# Altium schematic sheet OVERVIEW.SchDoc
size 558 x 431 mm; SheetNumber: 3; SheetTotal: 25; Sheet_Name: OVERVIEW; Size: 11x17
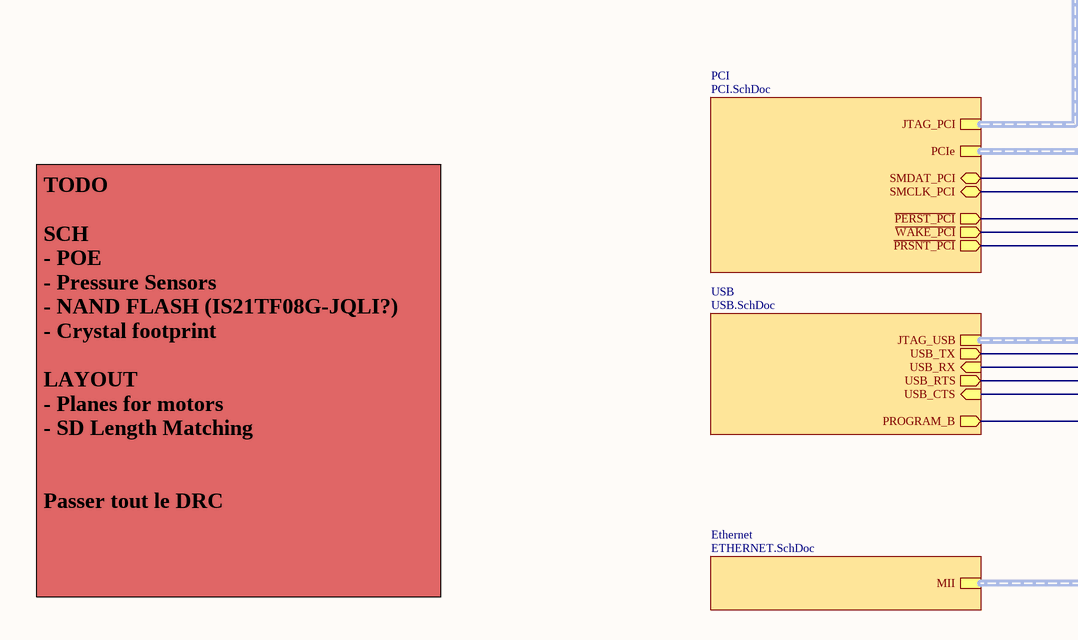
[diagram p0: OVERVIEW.SchDoc, top left]
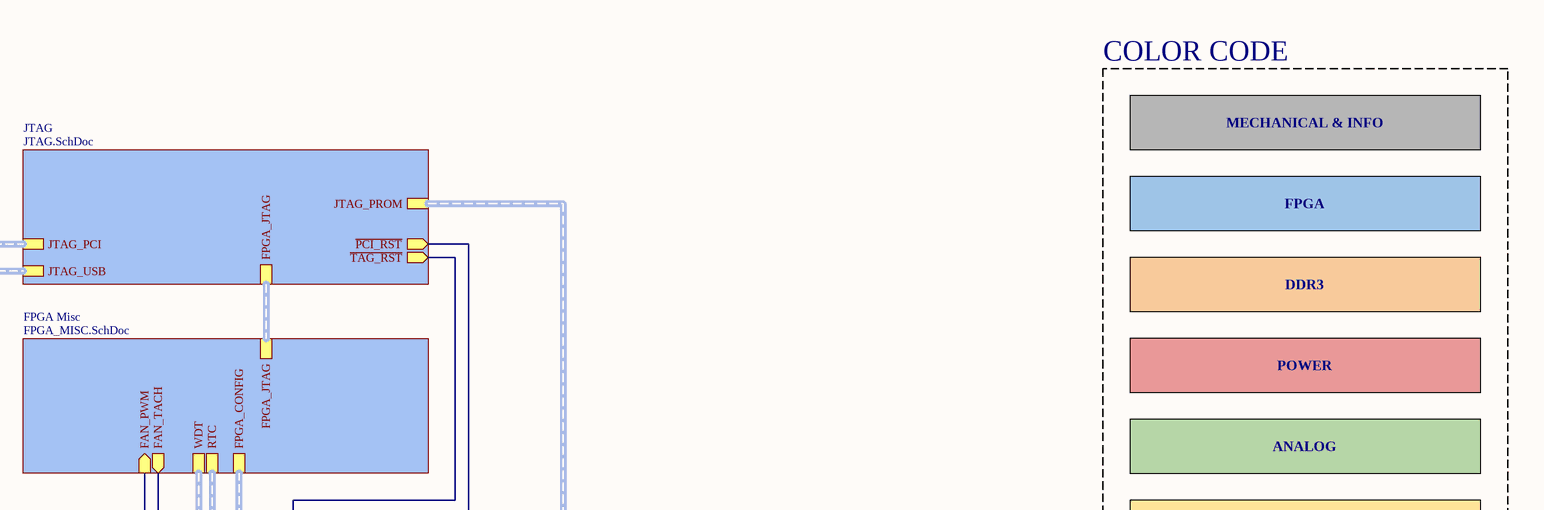
[diagram p1: OVERVIEW.SchDoc, top right]
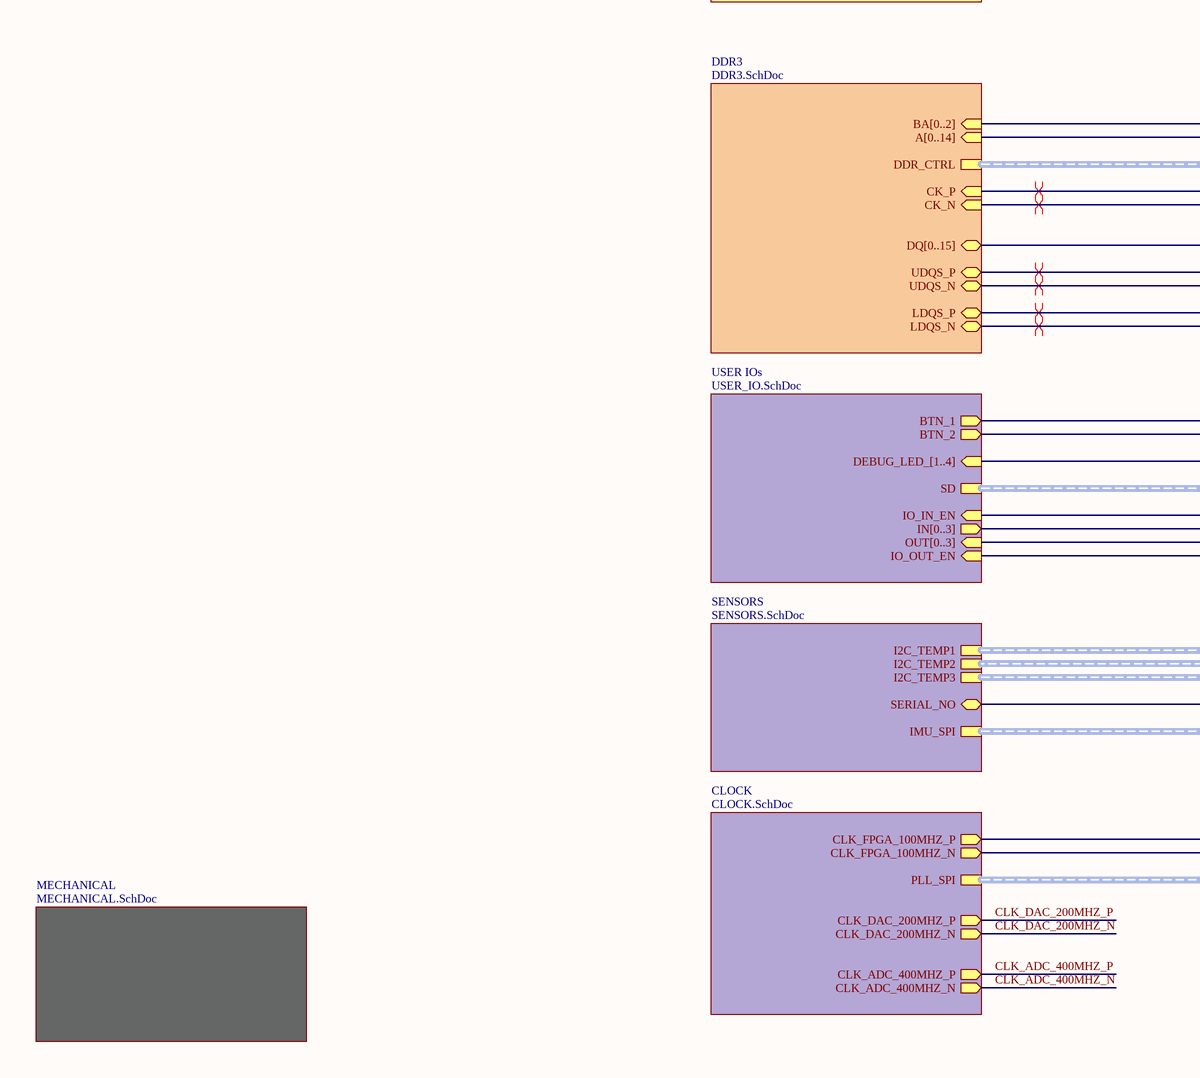
[diagram p2: OVERVIEW.SchDoc, bottom left]
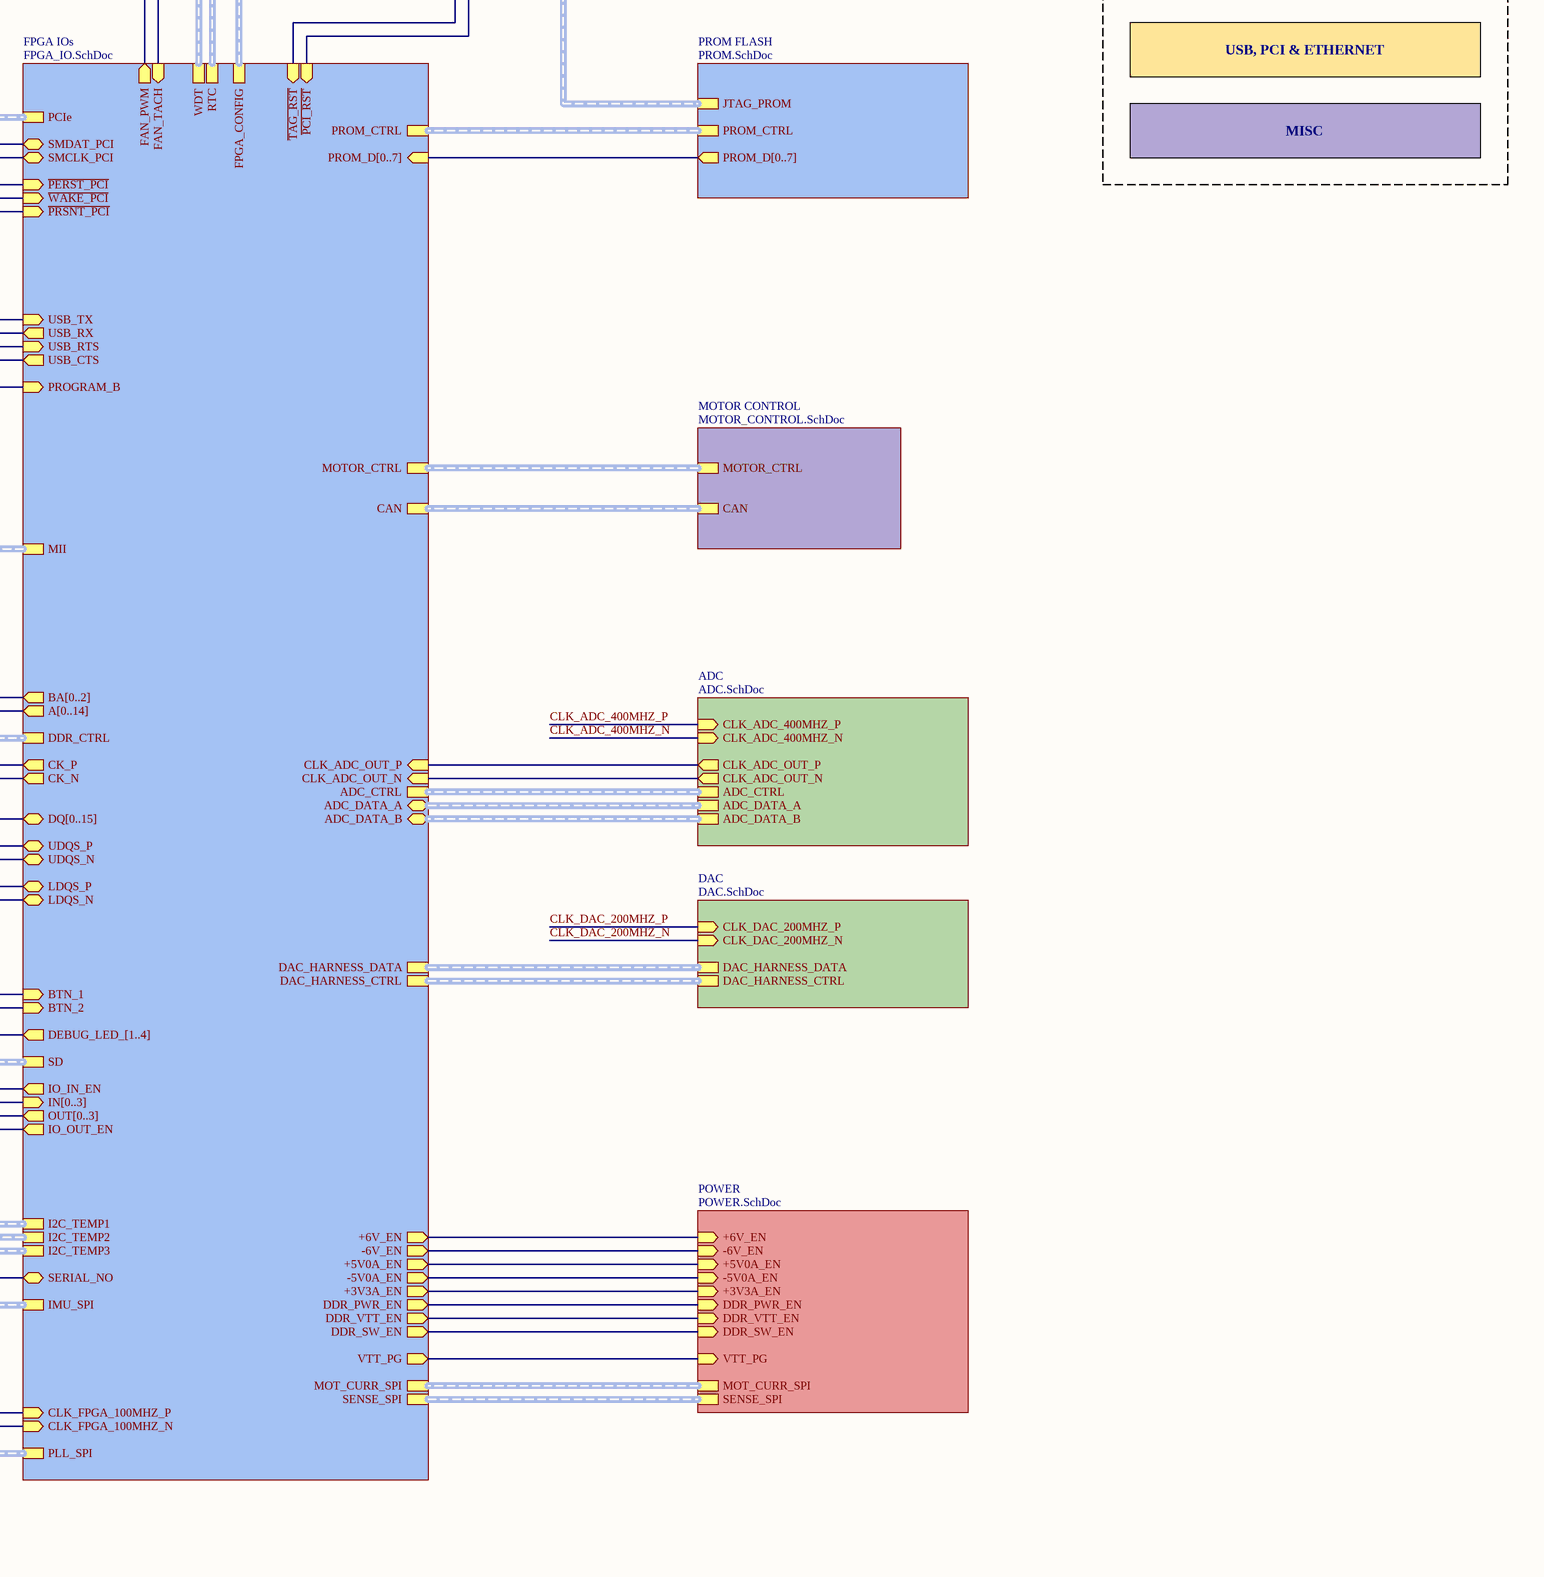
[diagram p3: OVERVIEW.SchDoc, bottom right]

## Sub-sheets
ADC = ADC.SchDoc: ADC_DATA_A (harness ADC_DATA_A), ADC_DATA_B (harness ADC_DATA_B), CLK_ADC_400MHZ_P (in), CLK_ADC_400MHZ_N (in), CLK_ADC_OUT_P (out), CLK_ADC_OUT_N (out), ADC_CTRL (harness ADC_CTRL)
CLOCK = CLOCK.SchDoc: PLL_SPI (harness PLL_HARNESS), CLK_FPGA_100MHZ_P (out), CLK_FPGA_100MHZ_N (out), CLK_DAC_200MHZ_P (out), CLK_DAC_200MHZ_N (out), CLK_ADC_400MHZ_P (out), CLK_ADC_400MHZ_N (out)
DAC = DAC.SchDoc: DAC_HARNESS_DATA (harness DAC_HARNESS_DATA), DAC_HARNESS_CTRL (harness DAC_HARNESS_CTRL), CLK_DAC_200MHZ_P (in), CLK_DAC_200MHZ_N (in)
DDR3 = DDR3.SchDoc: A[0..14] (in), DDR_CTRL (harness DDR3_HARNESS), BA[0..2] (in), DQ[0..15] (bidir), CK_P (in), CK_N (in), UDQS_P (bidir), UDQS_N (bidir), LDQS_P (bidir), LDQS_N (bidir)
Ethernet = ETHERNET.SchDoc: MII (harness ETHERNET_HARNESS)
FPGA IOs = FPGA_IO.SchDoc: BA[0..2] (out), CK_P (out), CK_N (out), UDQS_P (bidir), UDQS_N (bidir), LDQS_P (bidir), LDQS_N (bidir), BTN_1 (in), BTN_2 (in), CLK_FPGA_100MHZ_N (in), CLK_FPGA_100MHZ_P (in), ADC_DATA_A (bidir, harness ADC_DATA_A), DAC_HARNESS_DATA (harness DAC_HARNESS_DATA), DAC_HARNESS_CTRL (harness DAC_HARNESS_CTRL), ADC_DATA_B (bidir, harness ADC_DATA_B), USB_TX (in), USB_RX (out), USB_RTS (in), USB_CTS (out), CLK_ADC_OUT_P (in), CLK_ADC_OUT_N (in), A[0..14] (out), DQ[0..15] (bidir), DDR_CTRL (harness DDR3_HARNESS), MOTOR_CTRL (harness MOTOR_CTRL_HARNESS), PROM_D[0..7] (in), ADC_CTRL (harness ADC_CTRL), MII (harness ETHERNET_HARNESS), PLL_SPI (harness PLL_HARNESS), PROM_CTRL (harness PROM_HARNESS), DDR_SW_EN (out), VTT_PG (out), DDR_VTT_EN (out), DDR_PWR_EN (out), +5V0A_EN (out), -5V0A_EN (out), -6V_EN (out), +3V3A_EN (out), +6V_EN (out), FPGA_CONFIG (harness FPGA_CONFIG_HARNESS), SENSE_SPI (harness SENSE_SPI), DEBUG_LED_[1..4] (out), I2C_TEMP1 (harness I2C_HARNESS), I2C_TEMP2 (harness I2C_HARNESS), I2C_TEMP3 (harness I2C_HARNESS), PROGRAM_B (in), MOT_CURR_SPI (harness MOT_CURR_SPI), SD (harness SD_CARD_HARNESS), SERIAL_NO (bidir), ~{WAKE_PCI} (in), ~{PERST_PCI} (in), SMCLK_PCI (bidir), SMDAT_PCI (bidir), WDT (harness FPGA_WDT_HARNESS), ~{PCI_RST} (in), ~{TAG_RST} (in), PCIe (harness PCI_HARNESS), FAN_PWM (out), FAN_TACH (in), ~{PRSNT_PCI} (in), CAN (harness CAN_HARNESS), IN[0..3] (in), OUT[0..3] (out), IMU_SPI (harness IMU_HARNESS), RTC (harness RTC_HARNESS), IO_IN_EN (out), IO_OUT_EN (out)
FPGA Misc = FPGA_MISC.SchDoc: FPGA_CONFIG (harness FPGA_CONFIG_HARNESS), WDT (harness FPGA_WDT_HARNESS), FAN_PWM (in), FAN_TACH (out), FPGA_JTAG (harness JTAG_HARNESS), RTC (harness RTC_HARNESS)
JTAG = JTAG.SchDoc: ~{PCI_RST} (out), ~{TAG_RST} (out), JTAG_USB (harness JTAG_USB_HARNESS), JTAG_PROM (harness JTAG_HARNESS), JTAG_PCI (harness JTAG_PCI_HARNESS), FPGA_JTAG (harness JTAG_HARNESS)
MECHANICAL = MECHANICAL.SchDoc: no entries
MOTOR CONTROL = MOTOR_CONTROL.SchDoc: MOTOR_CTRL (harness MOTOR_CTRL_HARNESS), CAN (harness CAN_HARNESS)
PCI = PCI.SchDoc: ~{WAKE_PCI} (out), ~{PERST_PCI} (out), JTAG_PCI (harness JTAG_PCI_HARNESS), SMCLK_PCI (bidir), SMDAT_PCI (bidir), PCIe (harness PCI_HARNESS), ~{PRSNT_PCI} (out)
POWER = POWER.SchDoc: +3V3A_EN (in), -6V_EN (in), +6V_EN (in), -5V0A_EN (in), +5V0A_EN (in), DDR_PWR_EN (in), DDR_SW_EN (in), DDR_VTT_EN (in), VTT_PG (in), SENSE_SPI (harness SENSE_SPI), MOT_CURR_SPI (harness MOT_CURR_SPI)
PROM FLASH = PROM.SchDoc: PROM_CTRL (harness PROM_HARNESS), PROM_D[0..7] (out), JTAG_PROM (harness JTAG_HARNESS)
SENSORS = SENSORS.SchDoc: I2C_TEMP1 (harness I2C_HARNESS), I2C_TEMP2 (harness I2C_HARNESS), I2C_TEMP3 (harness I2C_HARNESS), SERIAL_NO (bidir), IMU_SPI (harness IMU_HARNESS)
USB = USB.SchDoc: JTAG_USB (harness JTAG_USB_HARNESS), USB_TX (out), USB_RX (in), USB_RTS (out), USB_CTS (in), PROGRAM_B (out)
USER IOs = USER_IO.SchDoc: BTN_1 (out), BTN_2 (out), DEBUG_LED_[1..4] (in), SD (harness SD_CARD_HARNESS), IN[0..3] (out), OUT[0..3] (in), IO_IN_EN (in), IO_OUT_EN (in)

## Nets
CLK_ADC_400MHZ_N: sheet ADC/CLK_ADC_400MHZ_N, sheet CLOCK/CLK_ADC_400MHZ_N
CLK_ADC_400MHZ_P: sheet ADC/CLK_ADC_400MHZ_P, sheet CLOCK/CLK_ADC_400MHZ_P
CLK_DAC_200MHZ_N: sheet DAC/CLK_DAC_200MHZ_N, sheet CLOCK/CLK_DAC_200MHZ_N
CLK_DAC_200MHZ_P: sheet DAC/CLK_DAC_200MHZ_P, sheet CLOCK/CLK_DAC_200MHZ_P
(unnamed): sheet DDR3/CK_P, sheet FPGA IOs/CK_P
(unnamed): sheet DDR3/CK_N, sheet FPGA IOs/CK_N
(unnamed): sheet DDR3/UDQS_P, sheet FPGA IOs/UDQS_P
(unnamed): sheet DDR3/UDQS_N, sheet FPGA IOs/UDQS_N
(unnamed): sheet DDR3/LDQS_P, sheet FPGA IOs/LDQS_P
(unnamed): sheet DDR3/LDQS_N, sheet FPGA IOs/LDQS_N
(unnamed): sheet POWER/+3V3A_EN, sheet FPGA IOs/+3V3A_EN
(unnamed): sheet POWER/-6V_EN, sheet FPGA IOs/-6V_EN
(unnamed): sheet POWER/+6V_EN, sheet FPGA IOs/+6V_EN
(unnamed): sheet POWER/-5V0A_EN, sheet FPGA IOs/-5V0A_EN
(unnamed): sheet POWER/+5V0A_EN, sheet FPGA IOs/+5V0A_EN
(unnamed): sheet POWER/DDR_PWR_EN, sheet FPGA IOs/DDR_PWR_EN
(unnamed): sheet POWER/DDR_SW_EN, sheet FPGA IOs/DDR_SW_EN
(unnamed): sheet POWER/DDR_VTT_EN, sheet FPGA IOs/DDR_VTT_EN
(unnamed): sheet POWER/VTT_PG, sheet FPGA IOs/VTT_PG
(unnamed): sheet ADC/CLK_ADC_OUT_P, sheet FPGA IOs/CLK_ADC_OUT_P
(unnamed): sheet ADC/CLK_ADC_OUT_N, sheet FPGA IOs/CLK_ADC_OUT_N
(unnamed): sheet FPGA Misc/FAN_PWM, sheet FPGA IOs/FAN_PWM
(unnamed): sheet FPGA Misc/FAN_TACH, sheet FPGA IOs/FAN_TACH
(unnamed): sheet FPGA IOs/BTN_1, sheet USER IOs/BTN_1
(unnamed): sheet FPGA IOs/BTN_2, sheet USER IOs/BTN_2
(unnamed): sheet FPGA IOs/CLK_FPGA_100MHZ_N, sheet CLOCK/CLK_FPGA_100MHZ_N
(unnamed): sheet FPGA IOs/CLK_FPGA_100MHZ_P, sheet CLOCK/CLK_FPGA_100MHZ_P
(unnamed): sheet FPGA IOs/USB_TX, sheet USB/USB_TX
(unnamed): sheet FPGA IOs/USB_RX, sheet USB/USB_RX
(unnamed): sheet FPGA IOs/USB_RTS, sheet USB/USB_RTS
(unnamed): sheet FPGA IOs/USB_CTS, sheet USB/USB_CTS
(unnamed): sheet FPGA IOs/PROGRAM_B, sheet USB/PROGRAM_B
(unnamed): sheet FPGA IOs/SERIAL_NO, sheet SENSORS/SERIAL_NO
(unnamed): sheet FPGA IOs/~{WAKE_PCI}, sheet PCI/~{WAKE_PCI}
(unnamed): sheet FPGA IOs/~{PERST_PCI}, sheet PCI/~{PERST_PCI}
(unnamed): sheet FPGA IOs/SMCLK_PCI, sheet PCI/SMCLK_PCI
(unnamed): sheet FPGA IOs/SMDAT_PCI, sheet PCI/SMDAT_PCI
(unnamed): sheet FPGA IOs/~{PCI_RST}, sheet JTAG/~{PCI_RST}
(unnamed): sheet FPGA IOs/~{TAG_RST}, sheet JTAG/~{TAG_RST}
(unnamed): sheet FPGA IOs/~{PRSNT_PCI}, sheet PCI/~{PRSNT_PCI}
(unnamed): sheet FPGA IOs/IO_IN_EN, sheet USER IOs/IO_IN_EN
(unnamed): sheet FPGA IOs/IO_OUT_EN, sheet USER IOs/IO_OUT_EN

## Buses and harness runs
bus sheet DDR3/A[0..14] = sheet FPGA IOs/A[0..14]
bus sheet DDR3/BA[0..2] = sheet FPGA IOs/BA[0..2]
bus sheet DDR3/DQ[0..15] = sheet FPGA IOs/DQ[0..15]
bus sheet FPGA IOs/DEBUG_LED_[1..4] = sheet USER IOs/DEBUG_LED_[1..4]
bus sheet FPGA IOs/IN[0..3] = sheet USER IOs/IN[0..3]
bus sheet FPGA IOs/OUT[0..3] = sheet USER IOs/OUT[0..3]
bus sheet FPGA IOs/PROM_D[0..7] = sheet PROM FLASH/PROM_D[0..7]
harness sheet ADC/ADC_CTRL = sheet FPGA IOs/ADC_CTRL
harness sheet ADC/ADC_DATA_A = sheet FPGA IOs/ADC_DATA_A
harness sheet ADC/ADC_DATA_B = sheet FPGA IOs/ADC_DATA_B
harness sheet CLOCK/PLL_SPI = sheet FPGA IOs/PLL_SPI
harness sheet DAC/DAC_HARNESS_CTRL = sheet FPGA IOs/DAC_HARNESS_CTRL
harness sheet DAC/DAC_HARNESS_DATA = sheet FPGA IOs/DAC_HARNESS_DATA
harness sheet DDR3/DDR_CTRL = sheet FPGA IOs/DDR_CTRL
harness sheet Ethernet/MII = sheet FPGA IOs/MII
harness sheet FPGA IOs/CAN = sheet MOTOR CONTROL/CAN
harness sheet FPGA IOs/FPGA_CONFIG = sheet FPGA Misc/FPGA_CONFIG
harness sheet FPGA IOs/I2C_TEMP1 = sheet SENSORS/I2C_TEMP1
harness sheet FPGA IOs/I2C_TEMP2 = sheet SENSORS/I2C_TEMP2
harness sheet FPGA IOs/I2C_TEMP3 = sheet SENSORS/I2C_TEMP3
harness sheet FPGA IOs/IMU_SPI = sheet SENSORS/IMU_SPI
harness sheet FPGA IOs/MOT_CURR_SPI = sheet POWER/MOT_CURR_SPI
harness sheet FPGA IOs/MOTOR_CTRL = sheet MOTOR CONTROL/MOTOR_CTRL
harness sheet FPGA IOs/PCIe = sheet PCI/PCIe
harness sheet FPGA IOs/PROM_CTRL = sheet PROM FLASH/PROM_CTRL
harness sheet FPGA IOs/RTC = sheet FPGA Misc/RTC
harness sheet FPGA IOs/SD = sheet USER IOs/SD
harness sheet FPGA IOs/SENSE_SPI = sheet POWER/SENSE_SPI
harness sheet FPGA IOs/WDT = sheet FPGA Misc/WDT
harness sheet FPGA Misc/FPGA_JTAG = sheet JTAG/FPGA_JTAG
harness sheet JTAG/JTAG_PCI = sheet PCI/JTAG_PCI
harness sheet JTAG/JTAG_PROM = sheet PROM FLASH/JTAG_PROM
harness sheet JTAG/JTAG_USB = sheet USB/JTAG_USB

## Layout directives
differential pair: (no net found under the mark)

## Notes on the sheet
- COLOR CODE
- MECHANICAL & INFO
- FPGA
- DDR3
- POWER
- ANALOG
- USB, PCI & ETHERNET
- MISC
- TODO
  SCH
  - POE
  - Pressure Sensors
  - NAND FLASH (IS21TF08G-JQLI?)
  - Crystal footprint
  LAYOUT
  - Planes for motors
  - SD Length Matching
  Passer tout le DRC
- Sheet Name
- Project Title
- Global Project
- Revision
- Size
- Date
- Group
- Sheet
- of
- Filename
- Designers